# EAGLE design Adafruit VCNL4020 Proximity and Light Sensor (EAGLE 9.6.2)
COMPANY: ADAFRUIT INDUSTRIES; DRAWN: KTOWN; REV: A
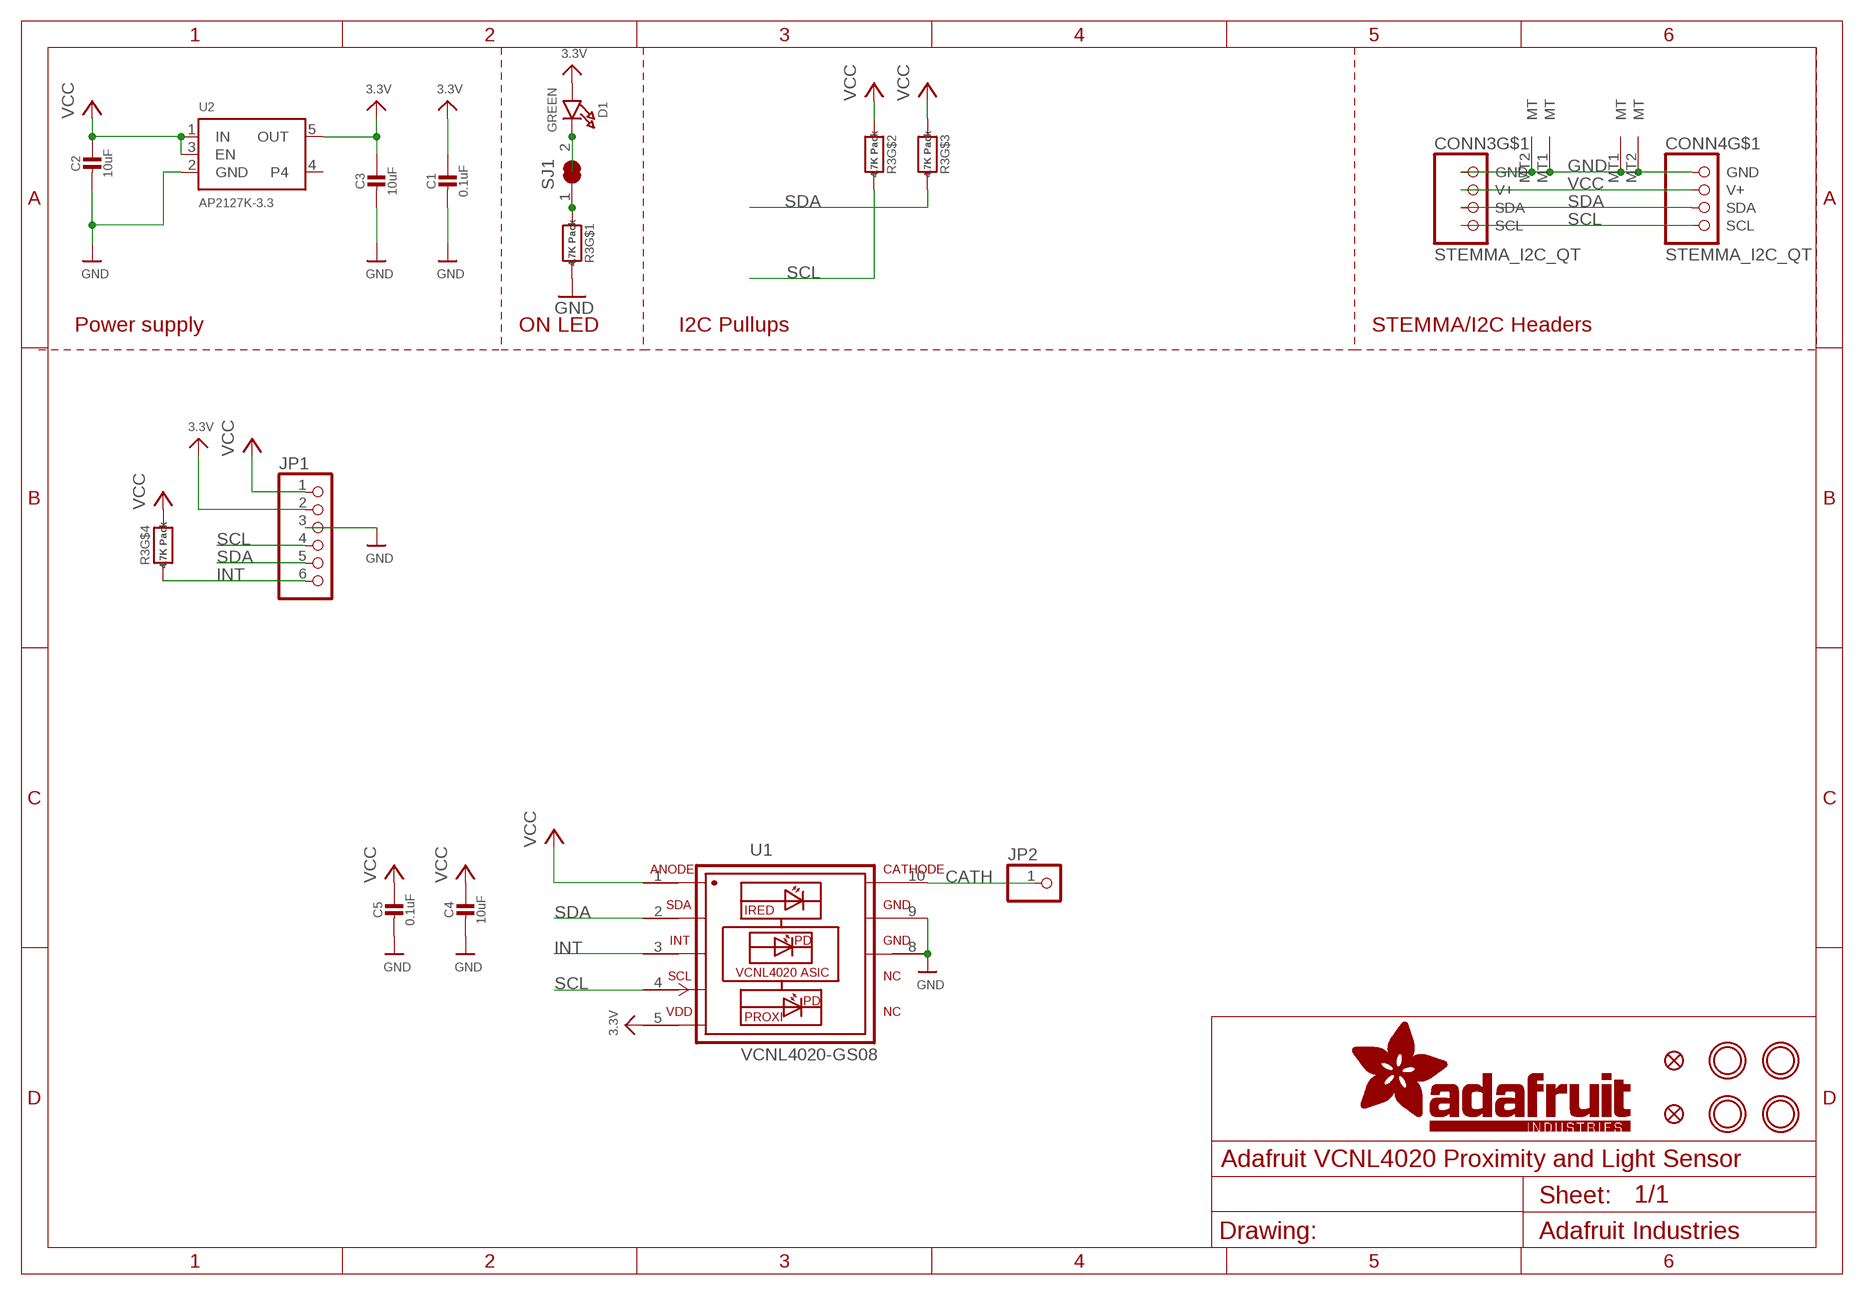
[diagram p0: schematic, sheet 1]

## Parts
C1  0.1uF  CAP_CERAMIC0603_NO  [0603-NO]
C2  10uF  CAP_CERAMIC0805-NOOUTLINE  [0805-NO]
C3  10uF  CAP_CERAMIC0805-NOOUTLINE  [0805-NO]
C4  10uF  CAP_CERAMIC0805-NOOUTLINE  [0805-NO]
C5  0.1uF  CAP_CERAMIC0603_NO  [0603-NO]
CONN3  STEMMA_I2C_QT  [JST_SH4]
CONN4  STEMMA_I2C_QT  [JST_SH4]
D1  GREEN  LED0603_NOOUTLINE  [CHIPLED_0603_NOOUTLINE]
FID3  FIDUCIAL_1MM  [FIDUCIAL_1MM]
FID4  FIDUCIAL_1MM  [FIDUCIAL_1MM]
JP1  HEADER-1X670MIL  [1X06_ROUND_70]
JP2  HEADER-1X1ROUND  [1X01_ROUND]
R3  4.7K Pack  RESISTOR_4PACK  [RESPACK_4X0603]
SJ1  SOLDERJUMPER_CLOSED  [SOLDERJUMPER_CLOSEDWIRE]
U1  VCNL4020-GS08  [PHODET_VCNL4020]
U2  AP2127K-3.3  VREG_SOT23-5  [SOT23-5]
U$1  MOUNTINGHOLE2.5  [MOUNTINGHOLE_2.5_PLATED]
U$17  MOUNTINGHOLE2.5  [MOUNTINGHOLE_2.5_PLATED]
U$19  MOUNTINGHOLE2.5  [MOUNTINGHOLE_2.5_PLATED]
U$21  MOUNTINGHOLE2.5  [MOUNTINGHOLE_2.5_PLATED]

## Nets
3.3V: C1.1 C3.1 D1.A JP1.2 U1.5(VDD) U2.5(OUT)
CATH: JP2.1 U1.10(IR-CATHODE)
GND: C1.2 C2.2 C3.2 C4.2 C5.2 CONN3.1(GND) CONN3.MT1(MT) CONN3.MT2(MT) CONN4.1(GND) CONN4.MT1(MT) CONN4.MT2(MT) JP1.3 R3.8 U1.8(GND2) U1.9(GND) U2.2(GND)
INT: JP1.6 R3.4 U1.3(INT)
N$1: D1.C SJ1.2
N$2: R3.1 SJ1.1
SCL: CONN3.4(SCL) CONN4.4(SCL) JP1.4 R3.7 U1.4(SCL)
SDA: CONN3.3(SDA) CONN4.3(SDA) JP1.5 R3.6 U1.2(SDA)
VCC: C2.1 C4.1 C5.1 CONN3.2(V+) CONN4.2(V+) JP1.1 R3.2 R3.3 R3.5 U1.1(IR-ANODE) U2.1(IN) U2.3(EN)
Unconnected: U2.4

## Notes on the sheet
- Power supply | ON LED | I2C Pullups | STEMMA/I2C Headers

## Library data of the parts
C1-C5 = microbuilder:CAP_CERAMIC: Ceramic Capacitors For new designs, use the packages preceded by an '_' character since they are more reliable: The following footprints should be used on most boards: _0402 - Standard footprint for regular board layouts _0603 - Standard footprint for regular board layouts _0805 - Standard footprint for regular board layouts _1206 - Standard footprint for regular board layouts For extremely tight-pitch boards where space is at a premium, the following 'micro-pitch' footprints can be used (smaller pads, no silkscreen outline, etc.): _0402MP - Micro-pitch footprint for very dense/compact boards _0603MP - Micro-pitch footprint for very dense/compact boards _0805MP - Micro-pitch footprint for very dense/compact boards _1206MP - Micro-pitch footprint for very dense/compact boards
CONN3 CONN4 = adafruit_electromech:STEMMA_I2C; LCSC: C2845363
D1 = microbuilder:LED: LED 0603 - 0603 Surface Mount Package 2mA: Green LED - Low Power (3.9mcd, 2ma, 1.7Vf) - Digikey: 475-2709-2-ND Orange LED - Low Power (9.8mcd, 2ma, 1.8Vf) - Digikey: 475-1194-2-ND Red LED - Low Power (5mcd, 2ma, 1.8Vf) - Digikey: 475-1195-2-ND Yellow LED - Low Power (7mcd, 2ma, 1.8Vf) - Digikey: 475-1196-2-ND 5mA: Blue LED - Low Power (17mcd, 5ma, 2.9Vf) - Digikey: LNJ937W8CRACT-ND 0805 - 0805 Surface Mount Package 2mA: Red LED (8.8mcd, 2mA, 1.8Vf, Clear) - Low Power [Digikey: 475-2510-1-ND] Green LED (5mcd, 2mA, 1.8Vf, Clear) - Low Power [Digikey: 475-2730-1-ND] Yellow LED (11.3mcd, 2mA, 1.8Vf, Clear) - Low Power [Digikey: 475-2555-1-ND] 20mA: Red LED (104mcd, 20mA, Diffused) - LS R976 [Digikey: 475-1278-6-ND] Red LED (12mcd, 20mA, 2.0Vf, Clear) - APT2012EC [Digikey: 754-1128-1-ND] Green LED (15mcd, 20mA, 2.2Vf, Clear) - APT2012GC [Digikey: 754-1131-1-ND] Orange LED (160mcd, 20mA, 2.1Vf, Clear) - APT2012SECK [Digikey: 754-1130-1-ND] 1206 - 1206 Surface Mount Package Green LED (26mcd, 20mA, Diffused) - LG N971 [Digikey: 475-1407-6-ND] Red LED (15mcd, 20mA, Diffused) - LH N974 [Digikey: 475-1416-6-ND] Cree - Cree High-Power Surface Mount LEDs XPEBWT-L1-0000-00D50 - White 111lm 350mA 2.9Vf 6200K 110° XTEAWT-00-0000-00000LEE3 - White 114lm 350mA 2.85Vf 5000K 115° Everlight - Everlight 45-21 Series Surface Mount LEDs 45-21/QK2C-B2832AC2CB2/2T - Warm White 2000mcd 20mA 3.25Vf 3050K 120° 45-21/LK2C-B38452C4CB2/2T - Nuetral White 2000mcd 20mA 3.25Vf 4150K 120° 45-21/LK2C-B50634C6CB2/2T - Cold White 2200mcd 20mA 3.25Vf 5650K 120° PLCC2 Reverse Mount LS T77K-J1L2-1-0-2-R18-Z - Red 11.25mcd 2mA 1.8Vf 630nm 120° LO T77K-L1M2-24-Z - Orange 19.6mcd 2mA 1.8Vf 606nm 120° LY T77K-K2M1-26-Z - Yellow 15.7mcd 2mA 1.8Vf 587nm 120°; ROT: 270
FID3 FID4 = microbuilder:FIDUCIAL: Fiducial Alignment Points Various fiducial points for machine vision alignment.; BOM: EXCLUDE
JP1 = microbuilder:HEADER-1X6: PIN HEADER
JP2 = microbuilder:HEADER-1X1: PIN HEADER
R3 = microbuilder:RESISTOR_4PACK: Resistor Packs (4 resistors) 4 x 0603 10K 1/16W - Digikey: YC164J-10KCT-ND
SJ1 = microbuilder:SOLDERJUMPER_CLOSED: Solder Jumper - Closed These solder jumpers are closed by default CLOSEDWIRE - 10 mil trace between pads that can be cut and resoldered later CLOSEDPERM - 63 mil trace between pads for a permanent connection (used to 'bridge' two signals, a shameless hack for Eagle). Can double as a test point as well (no cream layer)
U1 = adafruit_sensor:VCNL4020-GS08: VCNL4020 Fully Integrated Proximity and Ambient Light Sensor with Infrared Emitter, I2C Interface, and Interrupt Function: The VCNL4020 is a fully integrated proximity and ambient light sensor. Fully integrated means that the infrared emitter is included in the package. It has 16 bit resolution. It includes a signal processing IC and features standard I2C communication interface. It features an interrupt function. Device Model created 15.06.2016 by Johannes Kolb - Vishay Semiconductor GmbH; AVAILABILITY: Unavailable; DESCRIPTION: Optical Sensor Ambient I²C 10-VDFN; MF: Vishay Semiconductor; MP: VCNL4020-GS08; PACKAGE: VDFN-10 Vishay; PRICE: None
U2 = adafruit_power:VREG_SOT23-5: SOT23-5 Fixed Voltage Regulators Part Current Out V Out V In V Dropout θJA (°C/W) TJ (°C) Digikey Part No. ADP121 150mA 3.3V 3.4-5.5V 0.09V @ 150mA -- -- ADP121-AUJZ33R7CT-ND ADP121 150mA 3.0V 3.1-5.5V 0.09V @ 150mA -- -- ADP121-AUJZ30R7CT-ND ADP122 300mA 3.3V 3.4-5.5V 0.085V @ 300mA -- -- ADP122AUJZ-3.3-R7CT-ND ADP1712 300mA 3.3V 3.5-5.5V 0.17V @ 300mA -- -- ADP1712AUJZ-3.3-R7TR-ND AP7311 (Low Cost) 150mA 3.3V 3.5-6V 0.15V @ 150mA -- -- AP7311-33WG-7DICT-ND LD39015M18R 150mA 1.8V 1.9V-5.5V 0.08V @ 100mA -- -- 497-6977-1-ND LP2985A-33DBVR 150mA 3.3V 3.3-16V 0.28V @ 150mA 206 150 296-18479-1-ND MCP1824T-3302E/OT 300mA 3.3V 3.5V-6V 0.2V @ 300mA -- -- MCP1824T-3302E/OTCT-ND MIC5205-2.5YM5 TR 150mA 2.5V 2.7-16V 0.165V @ 150mA -- -- 576-1257-2-ND MIC5205-3.0YM5 TR 150mA 3.0V 3.2V-16V 0.165V @ 150mA -- -- 576-1258-2-ND MIC5205-3.3YM5 TR 150mA 3.3V 3.5V-16V 0.165V @ 150mA -- -- 576-1259-2-ND TPS780330220 150mA 3.3V+2.2V 3.6-5.5V 250mV Max -- -- 296-23332-1-ND TDA3663/N1,135 100mA 3.3V 3.5-45V 0.18V @ 50mA -- -- 568-5343-1-ND Max operating temp can be calculated using θJA, TJ (max junction temperature), and power in watts. Set the "Maximum Ambient Temperature" until it reaches TJ ("Max Junction Temperature"), which is the absolute limit for safe use of the regulator: Heat Sink Temperature Calculator <http://www.daycounter.com/Calculators/Heat-Sink-Temperature-Calculator.phtml> For example, With 12V source into a 3.3V LP2985 and a 30mA load, we are dissipating (12V-3.3V) * 0.03A = 0.261W. With a θJA of 206 °C/W, a TJ of 150°C, and 261mW we can safely use the chip without a heat sink up to 75°C (=147.1°C Junction Temperature).; JLC_ROTATION: 270
U$1 U$17 U$19 U$21 = adafruit_electromech:MOUNTINGHOLE: Mounting Hole For #2 screws (0.086"/2.18mm width, 0.094"/2.4mm hole) use 2.5mm; BOM: EXCLUDE

## Board
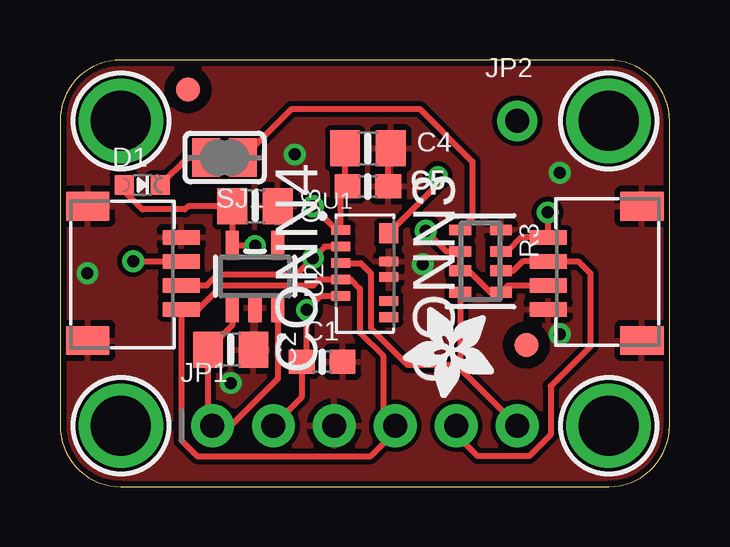
[diagram p1: board, top side]
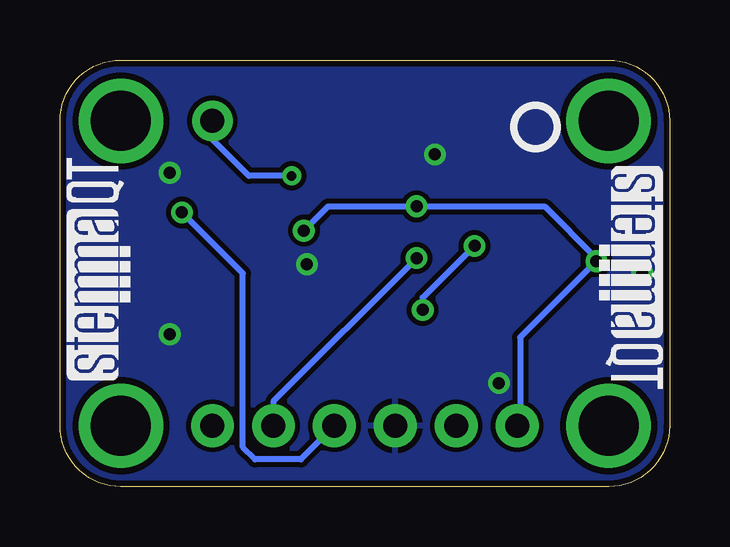
[diagram p2: board, bottom side, seen from below]

Size 25.4 x 17.78 mm. Coordinates in mm from the lower left corner, seen from the top.
Outline: 0,15.24 0,2.54 arc90 2.54,0 22.86,0 arc90 25.4,2.54 25.4,15.24 arc90 22.86,17.78 2.54,17.78 arc90 0,15.24
Copper layers (1*16): Top 0.035mm / dielectric 1.5mm / Bottom 0.035mm
Design rules "adafruit *": minimum track width 8mil, minimum drill 15.5mil, track to track 8mil, track to pad 8mil, pad to pad 8mil, via to via 8mil, smd to smd 8mil, copper to edge 10mil, drill to drill 8mil, minimum pad ring 10mil, minimum via ring 8mil, stop-mask expansion 2mil, vias tented up to drill 20mil, thermal gap 10mil

### Footprints (pad centres in the part's own frame; a part is rotated, then mirrored left to right if it is on the bottom)
0603-NO = smd 1.075 x 1: 1 -0.85,0; 2 0.85,0
0805-NO = smd 1.24 x 1.5: 1 -0.95,0; 2 0.95,0
JST_SH4 = smd 0.6 x 1.55: 1 -1.5,2.006; 2 -0.5,2.006; 3 0.5,2.006; 4 1.5,2.006 | smd 1.2 x 1.8: MT1 -2.8,-1.894; MT2 2.8,-1.894
CHIPLED_0603_NOOUTLINE = smd 0.8 x 0.8: A 0,-0.75; C 0,0.75
FIDUCIAL_1MM = smd 1 x 1: 1 0,0
1X06_ROUND_70 = drill 1 pad 1.778: 1 -6.35,0; 2 -3.81,0; 3 -1.27,0; 4 1.27,0; 5 3.81,0; 6 6.35,0
1X01_ROUND = drill 1 pad 1.676: 1 0,0
RESPACK_4X0603 = smd 0.45 x 0.9: 1 -1.3,-0.85; 2 -0.4,-0.85; 3 0.4,-0.85; 4 1.3,-0.85; 5 1.3,0.85; 6 0.4,0.85; 7 -0.4,0.85; 8 -1.3,0.85
SOLDERJUMPER_CLOSEDWIRE = smd 1.168 x 1.6: 1 -0.762,0; 2 0.762,0 | smd 0.635 x 0.203: WIRE 0,0
PHODET_VCNL4020 = smd 0.8 x 0.4: 1 -1,1.8; 2 -1,1.115; 3 -1,0.43; 4 -1,-0.255; 5 -1,-0.94; 6 1,-1.83; 7 1,-1.15; 8 1,-0.15; 9 1,0.5 | smd 0.8 x 0.83: 10 1,1.665
SOT23-5 = smd 0.55 x 1.2: 1 -0.95,-1.3; 2 0,-1.3; 3 0.95,-1.3; 4 0.95,1.3; 5 -0.95,1.3
MOUNTINGHOLE_2.5_PLATED = drill 2.5 pad 3.2: P$1 0,0

### Placement (x,y rotation side)
C1  10.92,5.21 0 top
C2  7.11,5.71 0 top
C3  8.13,11.68 0 top
C4  12.83,14.1 0 top
C5  12.83,12.51 0 top
CONN3  22.35,8.89 90 top
CONN4  3.05,8.89 270 top
D1  3.43,12.57 270 top
FID3  19.43,5.91 0 top
FID4  5.33,16.55 0 top
JP1  12.7,2.54 0 top
JP2  19.05,15.24 0 top
PLABEL0  [PLABEL0]  6.35,0.89 0 top
PLABEL1  [PLABEL1]  8.89,4.19 0 top
PLABEL2  [PLABEL2]  11.43,0.89 0 top
PLABEL3  [PLABEL3]  13.97,4.19 0 top
PLABEL4  [PLABEL4]  16.64,0.89 0 top
PLABEL5  [PLABEL5]  19.05,4.19 0 top
PLABEL7  [PLABEL7]  14.61,12.95 0 top
PLABEL8  [PLABEL8]  0.25,12.45 0 top
PLABEL10  [PLABEL10]  12.7,11.81 0 bottom
PLABEL11  [PLABEL11]  12.45,7.11 0 bottom
PLABEL12  [PLABEL12]  12.45,16.26 0 top
PLABEL13  [PLABEL13]  12.7,16 0 bottom
R3  17.53,9.4 270 top
SJ1  6.86,13.72 180 top
U1  12.7,8.89 0 top
U2  8.13,8.76 0 top
U$1  2.54,15.24 0 top
U$17  22.86,15.24 0 top
U$19  2.54,2.54 0 top
U$21  22.86,2.54 0 top
U$22  [ADAFRUIT_3.5MM]  18.1,7.49 180 top
U$25  [PCBFEAT-REV-040]  5.59,14.99 0 bottom
U$30  [STEMMAQT]  22.48,4.45 90 bottom
U$31  [STEMMAQT]  2.92,13.34 270 bottom

### Tracks (layer width: path | path; a pad name or v marks a point on that pad's centre or on a via)
3.3V  (via drill 0.5)
  Top 0.254: D1.A 2.68,12.31 3.43,11.56 5.21,11.56 5.33,11.68 C3.1 U2.5 7.21,10.03 v8.13,10.03 | U1.5 10.87,7.95 v10.29,7.37 10.29,5.42 C1.1 10.07,3.72 JP1.2
  Bottom 0.254: v8.13,10.03 10.29,7.87 v10.29,7.37
CATH  (via drill 0.39)
  Top 0.254: U1.10 15.75,12.6 v15.75,12.95
  Bottom 0.254: v15.75,12.95 17.53,12.95 19.05,14.48 JP2.1
GND  (via drill 0.5)
  Top 0.254: C5.2 13.68,14 C4.2
  other vias: 1.14,8.89 15.11,9.27 20.83,13.08 20.83,6.35 9.78,13.84 7.11,4.32
  pour Top: 0,17.78 25.4,17.78 25.4,0 0,0
  pour Bottom: 0,17.78 25.4,17.78 25.4,0 0,0
INT
  Top 0.254: U1.3 12.52,9.32 12.95,8.89 12.95,6.6 14.48,5.08 16.51,5.08 16.57,5.02 | 16.57,5.02 JP1.6 | R3.4 16.68,5.12 16.57,5.02
N$1
  Top 0.254: D1.C 5.32,13.72 SJ1.2
N$2
  Top 0.254: SJ1.1 9.65,15.75 14.99,15.75 17.18,13.55 17.18,11.21 R3.1
SCL  (via drill 0.5)
  Top 0.254: R3.7 18.63,9.8 19.22,10.39 CONN3.4 20.35,11.41 20.34,11.4 v20.32,11.43 | CONN4.4 5.76,7.39 6.77,8.39 10.55,8.39 10.79,8.63 U1.4 12.12,8.63 12.5,8.26 12.5,6.42 13.46,5.45 13.46,3.05 JP1.4 13.97,2.29 12.95,1.27 5.71,1.27 5.05,1.93 CONN4.4
  Bottom 0.254: JP1.4 15.37,1.14 17.27,1.14 17.78,1.65 17.78,8.89 v20.32,11.43
SDA  (via drill 0.5)
  Top 0.254: CONN4.3 6.12,8.39 6.58,8.85 9.87,8.85 v10.54,9.53 11.02,10.01 U1.2 | R3.6 18.88,9 19.28,9.39 CONN3.3 21.6,9.39 22.1,8.89 22.1,5.84 20.45,4.19 20.45,2.16 19.56,1.27 17.4,1.27 16.51,2.16 JP1.5
  Bottom 0.254: v10.54,9.53 16.51,3.56 JP1.5
VCC  (via drill 0.5)
  Top 0.254: C4.1 11.88,12.61 C5.1 11.7,12.23 U1.1 11.54,10.69 v10.54,11.68 | U2.1 7.18,6.73 C2.1 6.16,2.73 JP1.1 7.11,2.54 9.08,4.51 U2.3 | CONN3.2 20.34,8.38 18.66,8.38 R3.5 17.94,8.1 17.59,8.45 17.04,9 R3.3 R3.2 16.11,9.8 v15.24,10.67 | v3.05,9.4 CONN4.2
  Bottom 0.254: v15.24,10.67 14.22,11.68 v10.54,11.68 5.21,11.68 3.05,9.53 v3.05,9.4 6.22,6.22 6.22,2.67 JP1.1

### Text on the board
Pinguin_tBackup: VCNL4020C | VCNL4020 | Proximity / Sensor | on | 3Vo | SCL | INT | VIN | GND | SDA
Pinguin_bBackup: VCNL4020 | VCNL4020C | Proximity & / Ambient Light Sensor | VLogic/Vcc: 3-5VDC / I2C Address: 0x13